# Altium schematic sheet POWER.SchDoc
size A4; SheetNumber: 2; SheetTotal: 3; SPICEModelCacheKGGQNPCM: <root> / <DocumentId>KGGQNPCM</DocumentId> / <CacheFrame Number="0"> / <Model Name="diode" Kind="MDL"> / <Text>*Default Diode / *Diode Pinout: A,K / .MODEL DIODE D()</Text> / </Model> / <Model Name="led0" Kind="MDL"> / <Text>*Typ INFRARED GaAs LED: Vf=1.2V Vr=5V If=40mA trr=3uS / *LED Pinout: 1=A, 2=K / .MODEL LED0 D (IS=93.5P RS=84M N=2.63 BV=5 IBV=10U / + CJO=2.97P VJ=.75 M=.333 TT=4.32U)</Text> / </Model> / </CacheFrame> / </root>
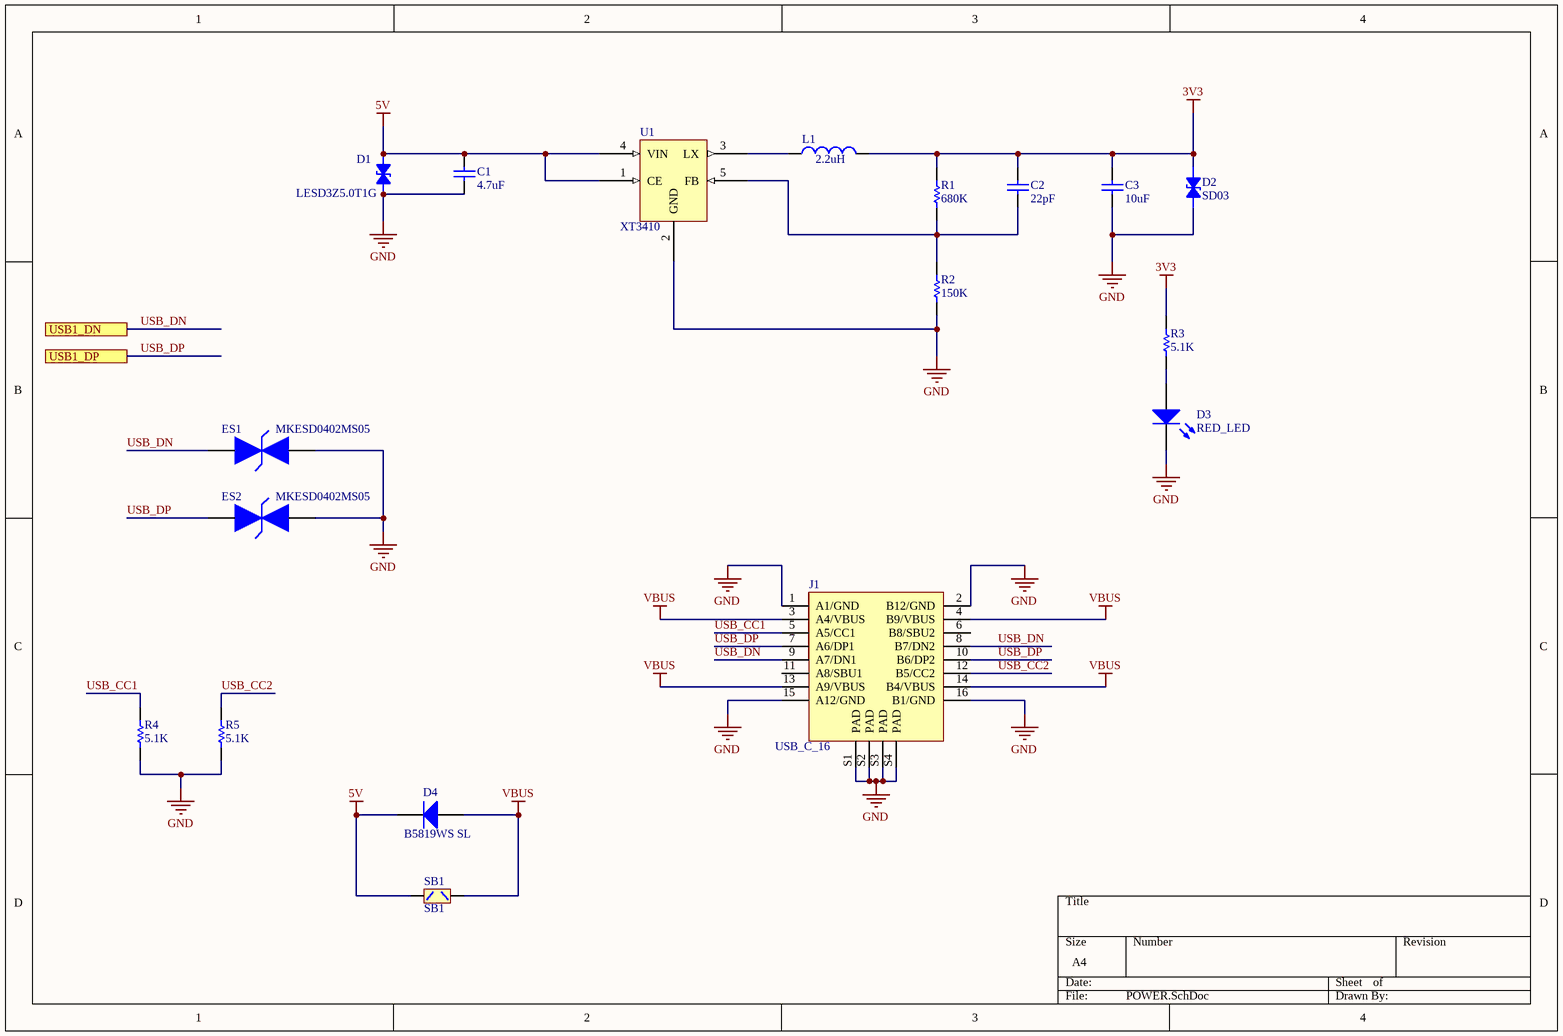
[diagram p0: POWER.SchDoc]

## Parts
C1  4.7uF  [0402_Capacitor]
C2  22pF  [0402_Capacitor]
C3  10uF  [0402_Capacitor]
D1  LESD3Z5.0T1G  [SOD-323]
D2  SD03  [SOD-323]
D3  RED_LED  [0603_LED_RED]
D4  B5819WS SL  [SOD-323]
ES1  MKESD0402MS05  [MKESD0402MS05]
ES2  MKESD0402MS05  [MKESD0402MS05]
J1  USB_C_16  [USB_C_16PIN_DIP]
L1  value 2.2uH  [2220(5650)_Inductor]  (hidden comment: Inductor)
R1  value 680K  [0402_Resistor]  (hidden comment: Res1)
R2  value 150K  [0402_Resistor]  (hidden comment: Res1)
R3  value 5.1K  [0402_Resistor]  (hidden comment: Res1)
R4  value 5.1K  [0402_Resistor]  (hidden comment: Res1)
R5  value 5.1K  [0402_Resistor]  (hidden comment: Res1)
SB1  SB1  [SB]
U1  XT3410  [SOT23_5L]

## Ports
USB1_DN (see MAIN[1A]), USB1_DP (see MAIN[1A])

## Nets
3V3: C2.2 C3.2 D2.1 L1.2 R1.2 R3.2
5V: C1.2 D1.1 D4.2(K) SB1.1 U1.1(CE) U1.4(VIN)
GND: C1.1 C3.1 D1.2 D2.2 D3.2(K) ES1.2 ES2.2 J1.1(A1/GND) J1.2(B12/GND) J1.15(A12/GND) J1.16(B1/GND) J1.S1(PAD) J1.S2(PAD) J1.S3(PAD) J1.S4(PAD) R2.1 R4.1 R5.1 U1.2(GND)
VBUS: D4.1(A) J1.3(A4/VBUS) J1.4(B9/VBUS) J1.13(A9/VBUS) J1.14(B4/VBUS) SB1.2
USB_CC1: J1.5(A5/CC1) R4.2
USB_CC2: J1.12(B5/CC2) R5.2
USB_DN: ES1.1 J1.8(B7/DN2) J1.9(A7/DN1) ; port USB1_DN
USB_DP: ES2.1 J1.7(A6/DP1) J1.10(B6/DP2) ; port USB1_DP
NetC2_1: C2.1 R1.1 R2.2 U1.5(FB)
NetD3_1: D3.1(A) R3.1
NetL1_1: L1.1 U1.3(LX)

Not connected (* = marked no-connect by the designer): J1 6(B8/SBU2) 11(A8/SBU1)

## Library data of the parts
C1-C3 = Cap: Capacitor; Published: 8-Jun-2000; LatestRevisionDate: 17-Jul-2002; LatestRevisionNote: Re-released for DXP Platform.; PackageReference: RAD-0.3; Publisher: Altium Limited; PackageDescription: Radial Cap, Thru-Hole; 2 Leads; 0.3 in Pin Spacing
  C1: Value: 4.7uF
  C2: Value: 22pF
  C3: Value: 10uF
D1 D2 = Diode
D3 = LED0: Typical INFRARED GaAs LED; Published: 8-Jun-2000; LatestRevisionDate: 08-Jul-2005; LatestRevisionNote: Mech Layer 1 removed.; PackageReference: LED-0; Publisher: Altium Limited; PackageDescription: LED; 2 Leads
D4 = Diode: Default Diode; Published: 8-Jun-2000; LatestRevisionDate: 17-Jul-2002; LatestRevisionNote: Re-released for DXP Platform.; PackageVersion: Sep-1996; PackageReference: SMC; Publisher: Altium Limited; PackageDescription: DO-214-AB/SMC; 2 C-Bend Leads; Body 7.9 x 5.9 mm, inc. leads (LxW); Code_JEDEC: DO-214-AB
ES1 ES2 = ESD1
L1 = Inductor: Code_IEC: 1005; Published: 8-Jun-2000; LatestRevisionDate: 29-May-2009; LatestRevisionNote: IPC-7351 Footprint Added.; PackageReference: 0402-A; Publisher: Altium Limited; PackageDescription: Chip Inductor; Code_JEITA: 0402
R1-R5 = Res1: Resistor; Published: 8-Jun-2000; LatestRevisionDate: 17-Jul-2002; LatestRevisionNote: Re-released for DXP Platform.; PackageReference: AXIAL-0.3; Publisher: Altium Limited; PackageDescription: Axial Device, Thru-Hole; 2 Leads; 0.3 in Pin Spacing
U1 = XT3410_My